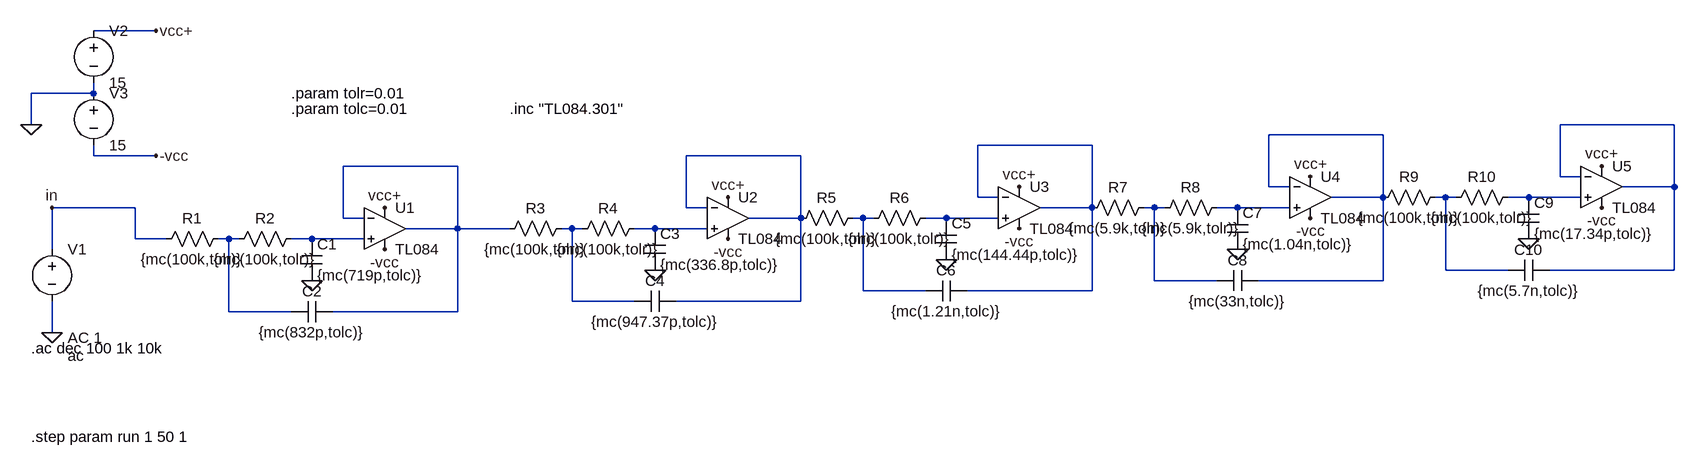
[diagram p0: schematic BP gyrator.asc]
BP gyrator.asc, the LTspice schematic file:
Version 4
SHEET 1 3080 680
WIRE 144 -192 48 -192
WIRE 48 -96 48 -112
WIRE 48 -96 -48 -96
WIRE -48 -48 -48 -96
WIRE 2480 -48 2304 -48
WIRE 2032 -32 1856 -32
WIRE 1584 -16 1408 -16
WIRE 48 0 48 -16
WIRE 144 0 48 0
WIRE 1136 0 960 0
WIRE 608 16 432 16
WIRE 2304 32 2304 -48
WIRE 2336 32 2304 32
WIRE 1856 48 1856 -32
WIRE 1888 48 1856 48
WIRE 2480 48 2480 -48
WIRE 2480 48 2400 48
WIRE 1408 64 1408 -16
WIRE 1440 64 1408 64
WIRE 2032 64 2032 -32
WIRE 2032 64 1952 64
WIRE 2128 64 2112 64
WIRE 2144 64 2128 64
WIRE 2256 64 2224 64
WIRE 2336 64 2256 64
WIRE 112 80 -16 80
WIRE 960 80 960 0
WIRE 992 80 960 80
WIRE 1584 80 1584 -16
WIRE 1584 80 1504 80
WIRE 1680 80 1664 80
WIRE 1696 80 1680 80
WIRE 1808 80 1776 80
WIRE 1888 80 1808 80
WIRE 432 96 432 16
WIRE 464 96 432 96
WIRE 1136 96 1136 0
WIRE 1136 96 1056 96
WIRE 1232 96 1216 96
WIRE 1248 96 1232 96
WIRE 1360 96 1328 96
WIRE 1440 96 1360 96
WIRE 608 112 608 16
WIRE 608 112 528 112
WIRE 688 112 608 112
WIRE 784 112 768 112
WIRE 800 112 784 112
WIRE 912 112 880 112
WIRE 992 112 912 112
WIRE 112 128 112 80
WIRE 160 128 112 128
WIRE 256 128 240 128
WIRE 272 128 256 128
WIRE 384 128 352 128
WIRE 464 128 384 128
WIRE -16 144 -16 80
WIRE 2128 176 2128 64
WIRE 2224 176 2128 176
WIRE 2480 176 2480 48
WIRE 2480 176 2288 176
WIRE 1680 192 1680 80
WIRE 1776 192 1680 192
WIRE 2032 192 2032 64
WIRE 2032 192 1840 192
WIRE 1232 208 1232 96
WIRE 1328 208 1232 208
WIRE 1584 208 1584 80
WIRE 1584 208 1392 208
WIRE 784 224 784 112
WIRE 880 224 784 224
WIRE 1136 224 1136 96
WIRE 1136 224 944 224
WIRE 256 240 256 128
WIRE 352 240 256 240
WIRE 608 240 608 112
WIRE 608 240 416 240
WIRE -16 272 -16 224
FLAG -16 272 0
FLAG 144 -192 vcc+
FLAG 496 80 vcc+
FLAG 144 0 -vcc
FLAG 496 144 -vcc
FLAG -48 -48 0
FLAG -16 80 in
FLAG 384 192 0
FLAG 1024 64 vcc+
FLAG 1024 128 -vcc
FLAG 912 176 0
FLAG 1472 48 vcc+
FLAG 1472 112 -vcc
FLAG 1360 160 0
FLAG 1920 32 vcc+
FLAG 1920 96 -vcc
FLAG 1808 144 0
FLAG 2368 16 vcc+
FLAG 2368 80 -vcc
FLAG 2256 128 0
SYMBOL voltage -16 128 R0
WINDOW 123 24 152 Left 2
WINDOW 39 24 124 Left 2
WINDOW 3 24 180 Left 2
SYMATTR Value2 AC 1
SYMATTR Value ac
SYMATTR InstName V1
SYMBOL Opamps\\opamp2 496 48 R0
SYMATTR InstName U1
SYMATTR Value TL084
SYMBOL voltage 48 -208 R0
SYMATTR InstName V2
SYMATTR Value 15
SYMBOL voltage 48 -112 R0
SYMATTR InstName V3
SYMATTR Value 15
SYMBOL res 256 112 R90
WINDOW 0 0 56 VBottom 2
WINDOW 3 32 56 VTop 2
SYMATTR InstName R1
SYMATTR Value {mc(100k,tolr)}
SYMBOL res 368 112 R90
WINDOW 0 0 56 VBottom 2
WINDOW 3 32 56 VTop 2
SYMATTR InstName R2
SYMATTR Value {mc(100k,tolr)}
SYMBOL cap 368 128 R0
SYMATTR InstName C1
SYMATTR Value {mc(719p,tolc)}
SYMBOL cap 416 224 R90
WINDOW 0 0 32 VBottom 2
WINDOW 3 32 32 VTop 2
SYMATTR InstName C2
SYMATTR Value {mc(832p,tolc)}
SYMBOL Opamps\\opamp2 1024 32 R0
SYMATTR InstName U2
SYMATTR Value TL084
SYMBOL res 784 96 R90
WINDOW 0 0 56 VBottom 2
WINDOW 3 32 56 VTop 2
SYMATTR InstName R3
SYMATTR Value {mc(100k,tolr)}
SYMBOL res 896 96 R90
WINDOW 0 0 56 VBottom 2
WINDOW 3 32 56 VTop 2
SYMATTR InstName R4
SYMATTR Value {mc(100k,tolr)}
SYMBOL cap 896 112 R0
SYMATTR InstName C3
SYMATTR Value {mc(336.8p,tolc)}
SYMBOL cap 944 208 R90
WINDOW 0 0 32 VBottom 2
WINDOW 3 32 32 VTop 2
SYMATTR InstName C4
SYMATTR Value {mc(947.37p,tolc)}
SYMBOL Opamps\\opamp2 1472 16 R0
SYMATTR InstName U3
SYMATTR Value TL084
SYMBOL res 1232 80 R90
WINDOW 0 0 56 VBottom 2
WINDOW 3 32 56 VTop 2
SYMATTR InstName R5
SYMATTR Value {mc(100k,tolr)}
SYMBOL res 1344 80 R90
WINDOW 0 0 56 VBottom 2
WINDOW 3 32 56 VTop 2
SYMATTR InstName R6
SYMATTR Value {mc(100k,tolr)}
SYMBOL cap 1344 96 R0
SYMATTR InstName C5
SYMATTR Value {mc(144.44p,tolc)}
SYMBOL cap 1392 192 R90
WINDOW 0 0 32 VBottom 2
WINDOW 3 32 32 VTop 2
SYMATTR InstName C6
SYMATTR Value {mc(1.21n,tolc)}
SYMBOL Opamps\\opamp2 1920 0 R0
SYMATTR InstName U4
SYMATTR Value TL084
SYMBOL res 1680 64 R90
WINDOW 0 0 56 VBottom 2
WINDOW 3 32 56 VTop 2
SYMATTR InstName R7
SYMATTR Value {mc(5.9k,tolr)}
SYMBOL res 1792 64 R90
WINDOW 0 0 56 VBottom 2
WINDOW 3 32 56 VTop 2
SYMATTR InstName R8
SYMATTR Value {mc(5.9k,tolr)}
SYMBOL cap 1792 80 R0
SYMATTR InstName C7
SYMATTR Value {mc(1.04n,tolc)}
SYMBOL cap 1840 176 R90
WINDOW 0 0 32 VBottom 2
WINDOW 3 32 32 VTop 2
SYMATTR InstName C8
SYMATTR Value {mc(33n,tolc)}
SYMBOL Opamps\\opamp2 2368 -16 R0
SYMATTR InstName U5
SYMATTR Value TL084
SYMBOL res 2128 48 R90
WINDOW 0 0 56 VBottom 2
WINDOW 3 32 56 VTop 2
SYMATTR InstName R9
SYMATTR Value {mc(100k,tolr)}
SYMBOL res 2240 48 R90
WINDOW 0 0 56 VBottom 2
WINDOW 3 32 56 VTop 2
SYMATTR InstName R10
SYMATTR Value {mc(100k,tolr)}
SYMBOL cap 2240 64 R0
SYMATTR InstName C9
SYMATTR Value {mc(17.34p,tolc)}
SYMBOL cap 2288 160 R90
WINDOW 0 0 32 VBottom 2
WINDOW 3 32 32 VTop 2
SYMATTR InstName C10
SYMATTR Value {mc(5.7n,tolc)}
TEXT -48 296 Left 2 !.ac dec 100 1k 10k
TEXT 352 -96 Left 2 !.param tolr=0.01
TEXT 352 -72 Left 2 !.param tolc=0.01
TEXT 688 -72 Left 2 !.inc "TL084.301"
TEXT -48 432 Left 2 !.step param run 1 50 1

The netlist it stands for:
* BP gyrator.asc
V1 in 0 ac AC 1
XU1 N015 N005 vcc+ -vcc N005 TL084  ; pins In+ In- V+ V- OUT
V2 vcc+ 0 15
V3 0 -vcc 15
R1 N014 in {mc(100k,tolr)}
R2 N015 N014 {mc(100k,tolr)}
C1 N015 0 {mc(719p,tolc)}
C2 N005 N014 {mc(832p,tolc)}
XU2 N013 N004 vcc+ -vcc N004 TL084  ; pins In+ In- V+ V- OUT
R3 N012 N005 {mc(100k,tolr)}
R4 N013 N012 {mc(100k,tolr)}
C3 N013 0 {mc(336.8p,tolc)}
C4 N004 N012 {mc(947.37p,tolc)}
XU3 N011 N003 vcc+ -vcc N003 TL084  ; pins In+ In- V+ V- OUT
R5 N010 N004 {mc(100k,tolr)}
R6 N011 N010 {mc(100k,tolr)}
C5 N011 0 {mc(144.44p,tolc)}
C6 N003 N010 {mc(1.21n,tolc)}
XU4 N009 N002 vcc+ -vcc N002 TL084  ; pins In+ In- V+ V- OUT
R7 N008 N003 {mc(5.9k,tolr)}
R8 N009 N008 {mc(5.9k,tolr)}
C7 N009 0 {mc(1.04n,tolc)}
C8 N002 N008 {mc(33n,tolc)}
XU5 N007 N001 vcc+ -vcc N001 TL084  ; pins In+ In- V+ V- OUT
R9 N006 N002 {mc(100k,tolr)}
R10 N007 N006 {mc(100k,tolr)}
C9 N007 0 {mc(17.34p,tolc)}
C10 N001 N006 {mc(5.7n,tolc)}
.ac dec 100 1k 10k
.param tolr=0.01
.param tolc=0.01
.inc "TL084.301"
.step param run 1 50 1
.backanno
.end